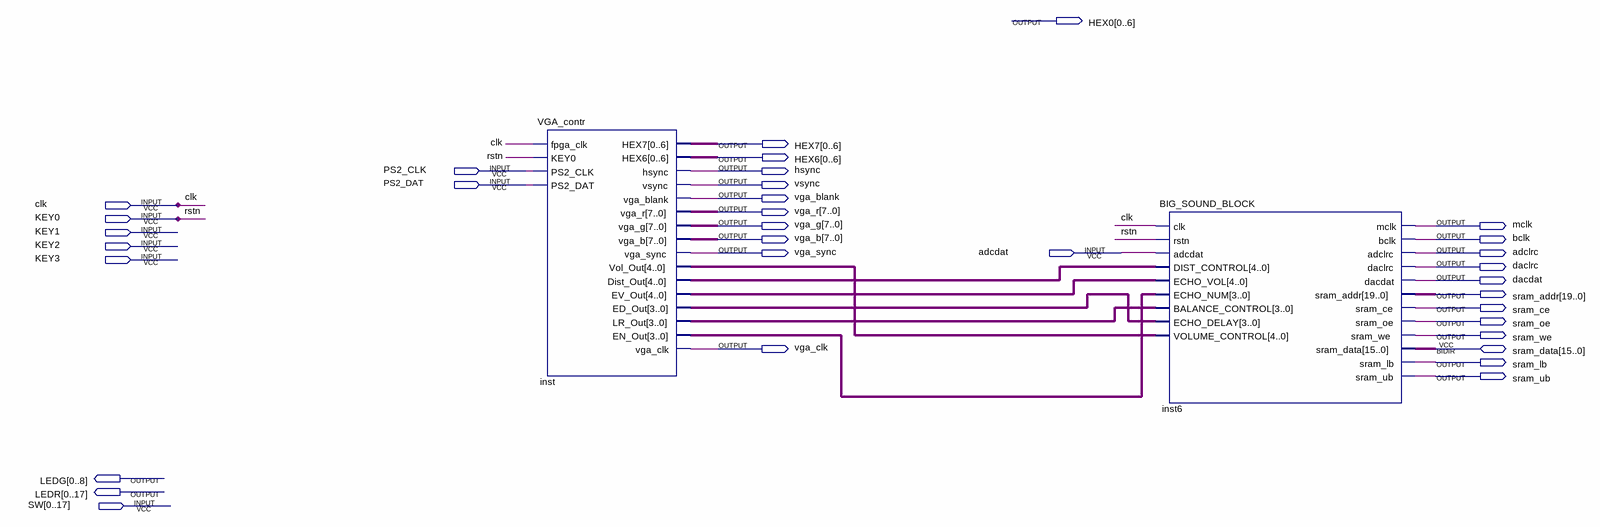
[diagram p0: schematic sheet]
// Quartus schematic Proj.bdf as structural Verilog: 2 symbols, 34 pins
module Proj (
  input  PS2_CLK,
  input  PS2_DAT,
  input  clk,
  input  KEY0,
  input  KEY1,
  input  KEY2,
  input  adcdat,
  input  KEY3,
  input  [0:17] SW,
  inout  [15:0] sram_data,
  output [0:6] HEX0,
  output [0:6] HEX7,
  output [0:6] HEX6,
  output hsync,
  output vsync,
  output vga_blank,
  output [7:0] vga_r,
  output [7:0] vga_g,
  output mclk,
  output [7:0] vga_b,
  output bclk,
  output vga_sync,
  output adclrc,
  output daclrc,
  output dacdat,
  output [19:0] sram_addr,
  output sram_ce,
  output sram_oe,
  output sram_we,
  output vga_clk,
  output sram_lb,
  output sram_ub,
  output [0:8] LEDG,
  output [0:17] LEDR
);

  wire [3:0] inst_ed_out, inst_en_out, inst_lr_out;
  wire [4:0] inst_dist_out, inst_ev_out, inst_vol_out;

  VGA_contr inst (
    .fpga_clk(clk), .KEY0(KEY0), .PS2_CLK(PS2_CLK), .PS2_DAT(PS2_DAT), .HEX7(HEX7), .HEX6(HEX6),
    .hsync(hsync), .vsync(vsync), .vga_blank(vga_blank), .vga_r(vga_r), .vga_g(vga_g), .vga_b(vga_b),
    .vga_sync(vga_sync), .Vol_Out(inst_vol_out), .Dist_Out(inst_dist_out), .EV_Out(inst_ev_out),
    .ED_Out(inst_ed_out), .LR_Out(inst_lr_out), .EN_Out(inst_en_out), .vga_clk(vga_clk));
  BIG_SOUND_BLOCK inst6 (
    .clk(clk), .rstn(KEY0), .adcdat(adcdat), .DIST_CONTROL(inst_dist_out), .ECHO_VOL(inst_ev_out),
    .ECHO_NUM(inst_en_out), .BALANCE_CONTROL(inst_lr_out), .ECHO_DELAY(inst_ed_out),
    .VOLUME_CONTROL(inst_vol_out), .mclk(mclk), .bclk(bclk), .adclrc(adclrc), .daclrc(daclrc),
    .dacdat(dacdat), .sram_addr(sram_addr), .sram_ce(sram_ce), .sram_oe(sram_oe), .sram_we(sram_we),
    .sram_lb(sram_lb), .sram_ub(sram_ub), .sram_data(sram_data));

  // Other names for the same wires on the sheet: rstn = KEY0
endmodule
